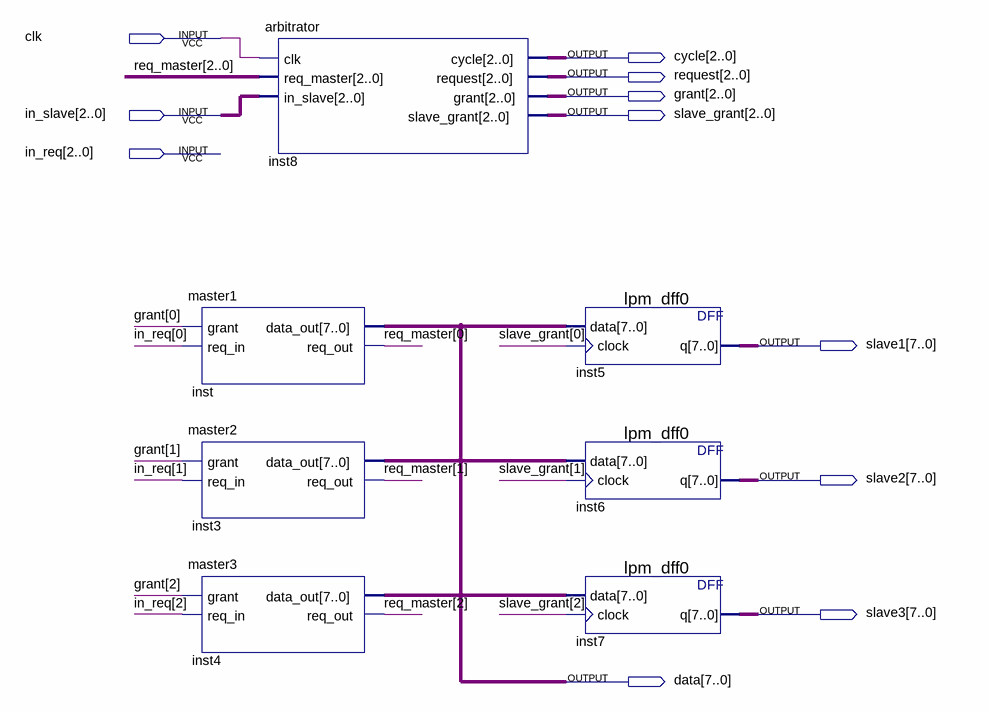
[diagram p0: schematic sheet]
// Quartus schematic main.bdf as structural Verilog: 7 symbols, 11 pins
module main (
  input  clk,
  input  [2:0] in_slave,
  input  [2:0] in_req,
  output [2:0] cycle,
  output [2:0] request,
  output [2:0] grant,
  output [2:0] slave_grant,
  output [7:0] slave1,
  output [7:0] slave2,
  output [7:0] slave3,
  output [7:0] data
);

  wire [2:0] req_master;

  master1 inst (.grant(grant[0]), .req_in(in_req[0]), .data_out(data), .req_out(req_master[0]));
  master2 inst3 (.grant(grant[1]), .req_in(in_req[1]), .data_out(data), .req_out(req_master[1]));
  master3 inst4 (.grant(grant[2]), .req_in(in_req[2]), .data_out(data), .req_out(req_master[2]));
  arbitrator inst8 (
    .clk(clk), .req_master(req_master), .in_slave(in_slave), .cycle(cycle), .request(request), .grant(grant),
    .slave_grant(slave_grant));
  lpm_dff0 inst5 (.data(data), .clock(slave_grant[0]), .q(slave1));
  lpm_dff0 inst6 (.data(data), .clock(slave_grant[1]), .q(slave2));
  lpm_dff0 inst7 (.data(data), .clock(slave_grant[2]), .q(slave3));
endmodule
